# EAGLE design PowerBrick (EAGLE 6.0)
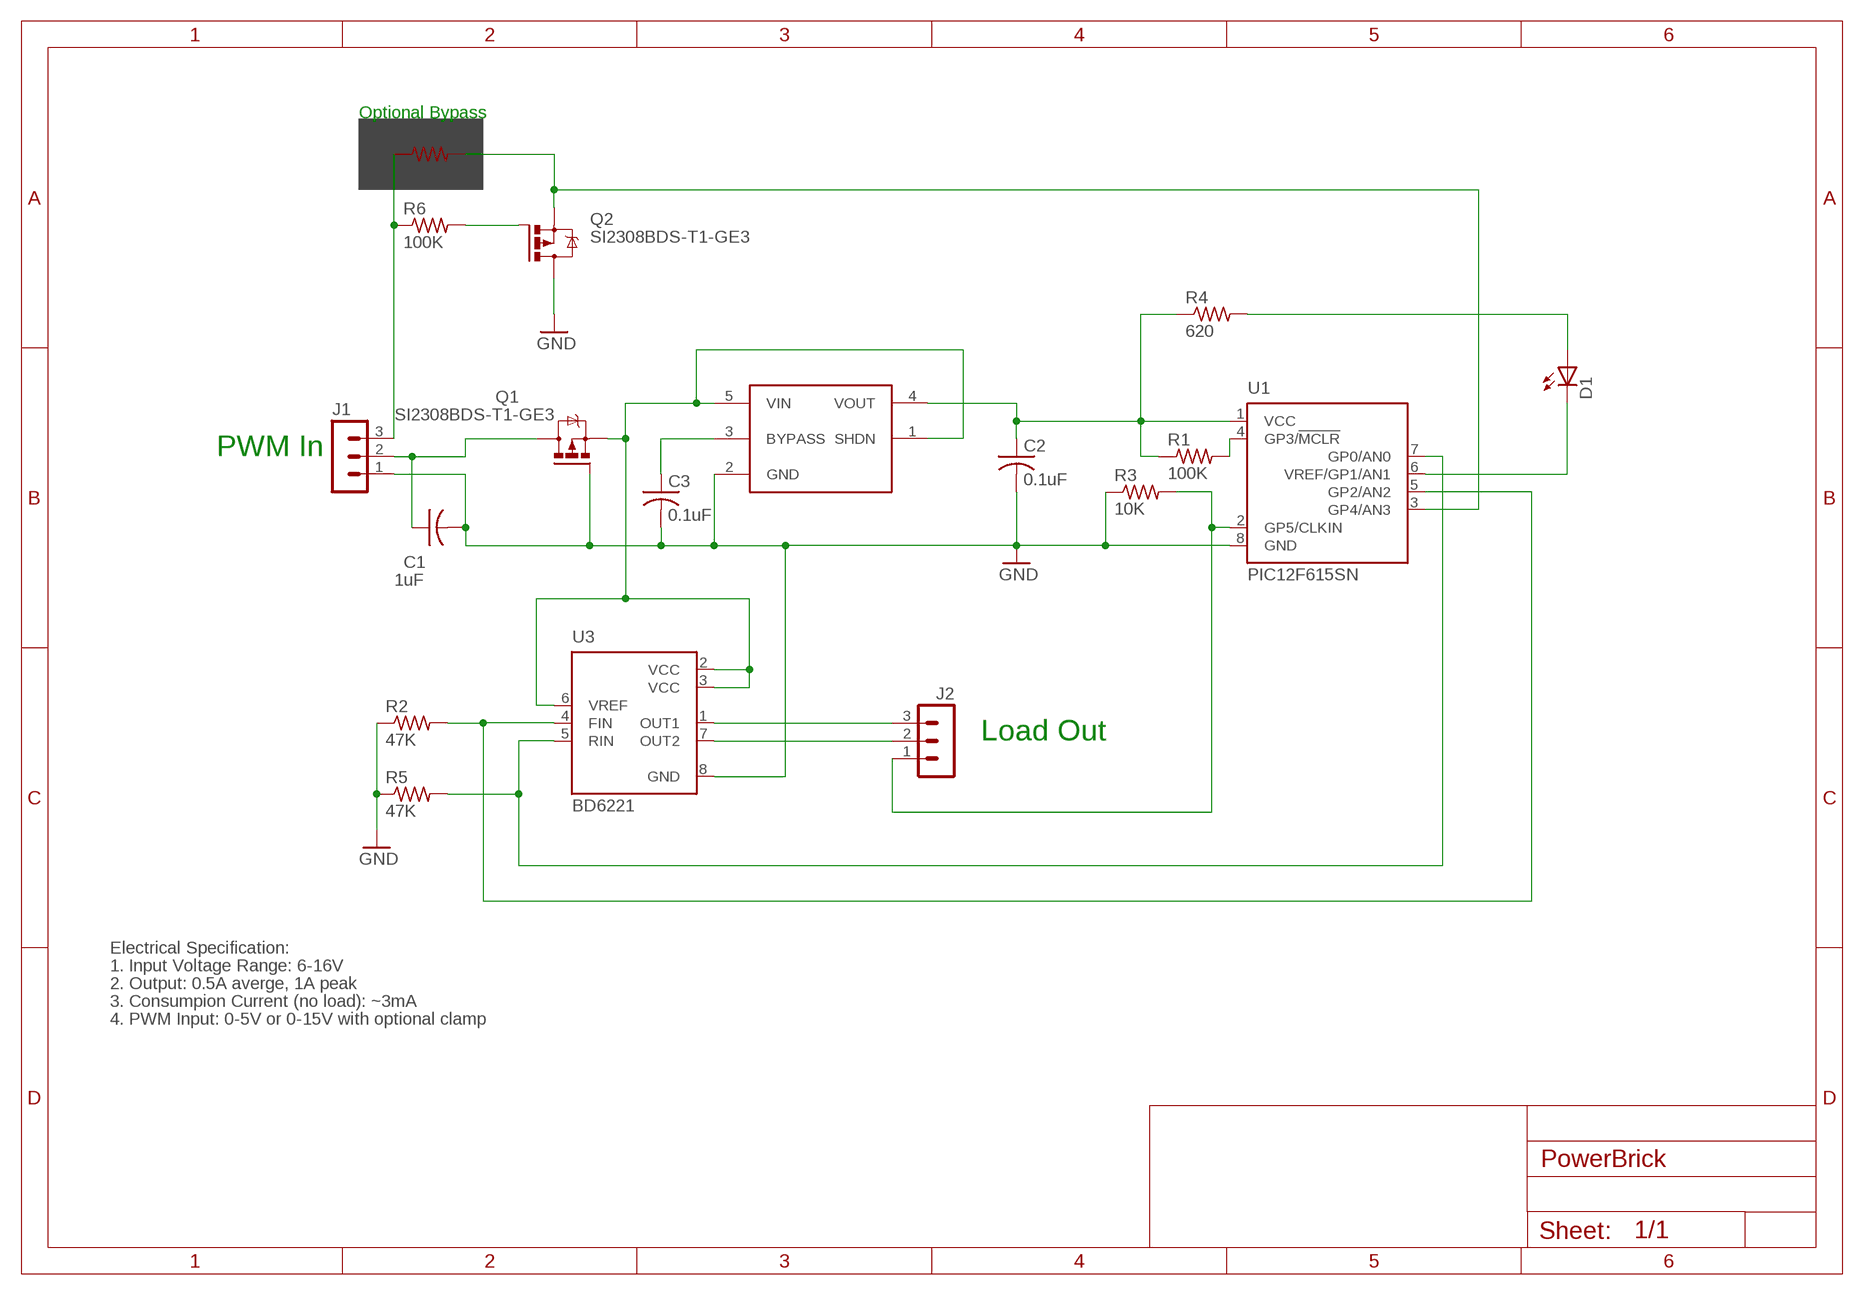
[diagram p0: schematic, sheet 1]

## Parts
C1  1uF  C-USC0805  [C0805]
C2  0.1uF  C-USC0805  [C0805]
C3  0.1uF  C-USC0805  [C0805]
D1  LEDCHIPLED_0603  [CHIPLED_0603]
J1  MA03-1  [MA03-1]
J2  MA03-1  [MA03-1]
Q1  SI2308BDS-T1-GE3  IRLML5203  [MICRO3]
Q2  SI2308BDS-T1-GE3  IRLML5203  [MICRO3]
R1  100K  R-US_R0603  [R0603]
R2  47K  R-US_R0603  [R0603]
R3  10K  R-US_R0603  [R0603]
R4  620  R-US_R0603  [R0603]
R5  47K  R-US_R0603  [R0603]
R6  100K  R-US_R0603  [R0603]
R7  0  R-US_R0603  [R0603]
U1  PIC12F615SN  PIC12H615SN  [SO-08]
U2  LK112M50TR  [SOT23-5L]
U3  BD6221  BD62XXBD6221  [SOP8]

## Nets
GND [power]: C1.2 C2.2 C3.2 J1.1 Q1.1(G) Q2.3(D) R2.1 R3.1 R5.1 U1.8(GND) U2.2(GND) U3.8(GND)
J1: Q2.2(S) R7.2 U1.3(GP4/AN3)
N$1 [power]: J2.1 R3.2 U1.2(GP5/CLKIN)
N$2 [power]: Q1.2(S) U2.1(SHDN) U2.5(VIN) U3.2(VCC) U3.3(VCC) U3.6(VREF)
N$3: C2.1 R1.1 R4.1 U1.1(VCC) U2.4(VOUT)
N$4: J2.3 U3.1(OUT1)
N$5 [power]: J2.2 U3.7(OUT2)
N$6: R2.2 U1.5(GP2/AN2) U3.4(FIN)
N$7: R5.2 U1.7(GP0/AN0) U3.5(RIN)
N$8: D1.A R4.2
N$9: D1.C U1.6(VREF/GP1/AN1)
N$10 [power]: C1.1 J1.2 Q1.3(D)
N$11: R1.2 U1.4(GP3/!MCLR)
N$12: Q2.1(G) R6.2
N$13: J1.3 R6.1 R7.1
N$15: C3.1 U2.3(BYPASS)

## Notes on the sheet
- Optional Bypass
- PWM In
- Load Out
- Electrical Specification:
- 1. Input Voltage Range: 6-16V
- 2. Output: 0.5A averge, 1A peak
- 3. Consumpion Current (no load): ~3mA
- 4. PWM Input: 0-5V or 0-15V with optional clamp

## Library data of the parts
C1-C3 = rcl:C-US: CAPACITOR, American symbol
D1 = led:LED: LED OSRAM: - CHIPLED LG R971, LG N971, LY N971, LG Q971, LY Q971, LO R971, LY R971 LH N974, LH R974 LS Q976, LO Q976, LY Q976 LO Q996 - Hyper CHIPLED LW Q18S LB Q993, LB Q99A, LB R99A - SideLED LS A670, LO A670, LY A670, LG A670, LP A670 LB A673, LV A673, LT A673, LW A673 LH A674 LY A675 LS A676, LA A676, LO A676, LY A676, LW A676 LS A679, LY A679, LG A679 - Hyper Micro SIDELED® LS Y876, LA Y876, LO Y876, LY Y876 LT Y87S - SmartLED LW L88C, LW L88S LB L89C, LB L89S, LG L890 LS L89K, LO L89K, LY L89K LS L896, LA L896, LO L896, LY L896 - TOPLED LS T670, LO T670, LY T670, LG T670, LP T670 LSG T670, LSP T670, LSY T670, LOP T670, LYG T670 LG T671, LOG T671, LSG T671 LB T673, LV T673, LT T673, LW T673 LH T674 LS T676, LA T676, LO T676, LY T676, LB T676, LH T676, LSB T676, LW T676 LB T67C, LV T67C, LT T67C, LS T67K, LO T67K, LY T67K, LW E67C LS E67B, LA E67B, LO E67B, LY E67B, LB E67C, LV E67C, LT E67C LW T67C LS T679, LY T679, LG T679 LS T770, LO T770, LY T770, LG T770, LP T770 LB T773, LV T773, LT T773, LW T773 LH T774 LS E675, LA E675, LY E675, LS T675 LS T776, LA T776, LO T776, LY T776, LB T776 LHGB T686 LT T68C, LB T68C - Hyper Mini TOPLED® LB M676 - Mini TOPLED Santana® LG M470 LS M47K, LO M47K, LY M47K Source: http://www.osram.convergy.de LUXEON: - LUMILED® LXK2-PW12-R00, LXK2-PW12-S00, LXK2-PW14-U00, LXK2-PW14-V00 LXK2-PM12-R00, LXK2-PM12-S00, LXK2-PM14-U00 LXK2-PE12-Q00, LXK2-PE12-R00, LXK2-PE12-S00, LXK2-PE14-T00, LXK2-PE14-U00 LXK2-PB12-K00, LXK2-PB12-L00, LXK2-PB12-M00, LXK2-PB14-N00, LXK2-PB14-P00, LXK2-PB14-Q00 LXK2-PR12-L00, LXK2-PR12-M00, LXK2-PR14-Q00, LXK2-PR14-R00 LXK2-PD12-Q00, LXK2-PD12-R00, LXK2-PD12-S00 LXK2-PH12-R00, LXK2-PH12-S00 LXK2-PL12-P00, LXK2-PL12-Q00, LXK2-PL12-R00 Source: www.luxeon.com KINGBRIGHT: KA-3528ASYC Source: www.kingbright.com
J1 J2 = con-lstb:MA03-1: PIN HEADER; OC_FARNELL: unknown; OC_NEWARK: unknown
Q1 Q2 = transistor-power:IRLML5203: HEXFET P-Channel Power MOSFET
R1-R7 = resistor:R-US_: RESISTOR, American symbol
U1 = personal:PIC12H615: 8-Pin FLASH-Based 8-Bit CMOS Microcontroller Precision Internal 4 MHz oscillator factory calibrated to ±1% Low Power Features: Standby Current: - 1 nA @ 2.0V, typical Operating Current: - 8.5µA @ 32 kHz, 2.0V, typical - 100µA @ 1 MHz, 2.0V, typical Watchdog Timer Current: - 300 nA @ 2.0V, typical Timer1 oscillator current: - 4µA @ 32 kHz, 2.0V, typical Analog-to-Digital Converter module: - 10-bit resolution - Programmable 4-channel input - Voltage reference input; MF: MICROCHIP; MPN: PIC12F675-E/SN; OC_FARNELL: 9759026; OC_NEWARK: 92C4341
U2 = personal:LK112M50TR: LDO, 5V, 150mA Datasheet: http://www.st.com/internet/com/TECHNICAL_RESOURCES/TECHNICAL_LITERATURE/DATASHEET/CD00002190.pdf
U3 = personal:BD62XX: H-bridge driver for brush motors Source: http://www.rohm.com/products/databook/motor/pdf/bd623x_series-e.pdf

## Net classes
0 default: width 0.203 mm
1 power: width 0.406 mm

## Board
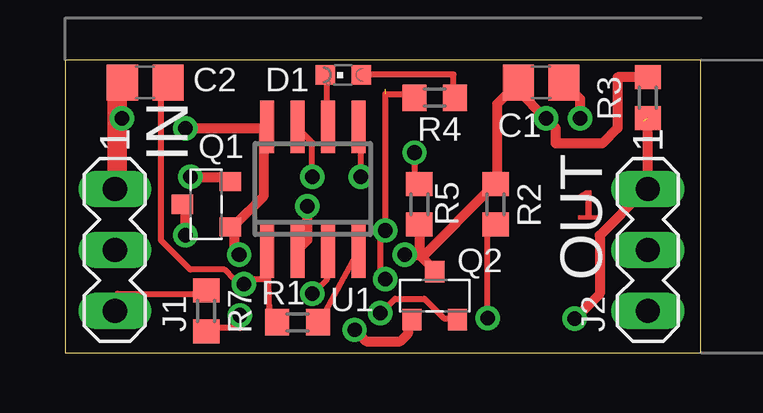
[diagram p1: board, top side]
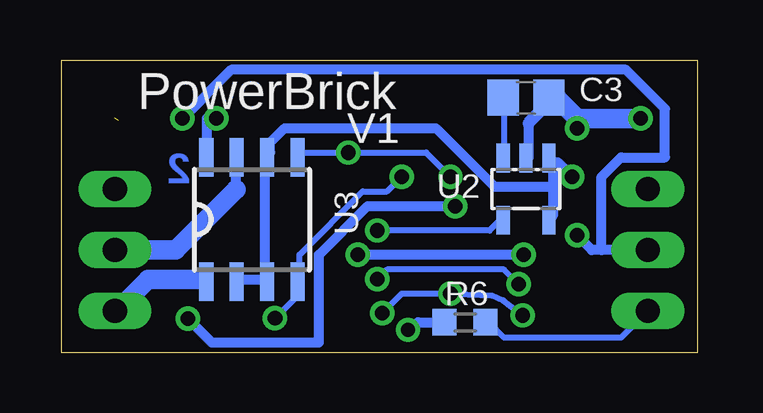
[diagram p2: board, bottom side, seen from below]

Size 26.5 x 12.21 mm. Coordinates in mm from the lower left corner, seen from the top.
Outline: 0,0 26.5,0 26.5,12.21 0,12.21 0,0
Copper layers (1*16): Top 0.035mm / dielectric 1.5mm / Bottom 0.035mm
Design rules: minimum track width 10mil, minimum drill 24mil, track to track 8mil, track to pad 8mil, pad to pad 8mil, via to via 8mil, smd to smd 8mil, copper to edge 40mil, drill to drill 8mil, minimum pad ring 10mil, minimum via ring 8mil, stop-mask expansion 4mil, vias tented up to drill 0mil, thermal gap 10mil

### Footprints (pad centres in the part's own frame; a part is rotated, then mirrored left to right if it is on the bottom)
C0805 = smd 1.3 x 1.5: 1 -0.95,0; 2 0.95,0
CHIPLED_0603 = smd 0.8 x 0.8: A 0,-0.75; C 0,0.75
MA03-1 = drill 1.016 long: 1 -2.54,0; 2 0,0; 3 2.54,0
MICRO3 = smd 0.8 x 0.9: 1 -0.95,-1; 2 0.95,-1; 3 0,1
R0603 = smd 1 x 1.1: 1 -0.85,0; 2 0.85,0
SO-08 = smd 0.6 x 2.2: 1 -1.905,-2.6; 2 -0.635,-2.6; 3 0.635,-2.6; 4 1.905,-2.6; 5 1.905,2.6; 6 0.635,2.6; 7 -0.635,2.6; 8 -1.905,2.6
SOT23-5L = smd 0.55 x 1.2: 1 -0.95,-1.3; 2 0,-1.3; 3 0.95,-1.3; 4 0.95,1.3; 5 -0.95,1.3
SOP8 = smd 0.6 x 1.6: 1 -1.905,-2.6; 2 -0.635,-2.6; 3 0.635,-2.6; 4 1.905,-2.6; 5 1.905,2.6; 6 0.635,2.6; 7 -0.635,2.6; 8 -1.905,2.6

### Placement (x,y rotation side)
C1  19.84,11.27 180 top
C2  3.33,11.27 180 top
C3  7.14,10.64 0 bottom
D1  11.59,11.59 90 top
J1  2.06,4.29 270 top
J2  24.29,4.29 270 top
Q1  5.87,6.19 90 top
Q2  15.4,2.38 0 top
R1  9.68,1.27 0 top
R2  17.94,6.19 270 top
R3  24.29,10.64 270 top
R4  15.4,10.64 0 top
R5  14.76,6.19 90 top
R6  9.68,1.27 180 bottom
R7  5.87,1.75 270 top
U1  10.32,6.83 0 top
U2  7.14,6.83 180 bottom
U3  18.57,5.56 0 bottom

### Tracks (layer width: path | path; a pad name or v marks a point on that pad's centre or on a via)
GND  (via drill 0.61)
  Top 0.406: 14.76,4.08 14.87,3.98 | 14.87,3.98 15.37,3.47 Q2.3 | R5.1 14.76,4.08 | 14.87,3.98 17.81,6.93 R2.1 18.01,7.13 18.01,10.38 18.83,11.2 C1.2 18.83,10.99 v20.05,9.77 20.45,9.37 20.45,8.73 22.38,8.73 23.02,9.37 23.02,11.49 R3.1 | 8.26,9.37 8.26,6.52 7.04,5.3 Q1.1 7.04,5.1 7.04,4.29 v7.25,4.08 | 8.26,9.37 U1.8 8.46,9.57 | 2.17,10.99 2.37,11.2 C2.2 | 2.17,6.93 J1.1 | 2.17,9.77 v2.37,9.77 | v5.01,9.37 8.26,9.37 | v14.15,4.08 14.76,4.08
  Top 0.813: 2.17,6.93 2.17,9.77 2.17,10.99
  Bottom 0.406: 7.04,9.57 7.04,8.15 U2.2 | 6.03,10.59 C3.2 5.82,10.59 | 5.01,9.77 v5.01,9.37 | v7.25,4.08 v14.15,4.08 | v20.05,9.77 20.45,9.77 20.45,8.35 U3.8
  Bottom 0.508: 6.03,10.59 7.04,9.57
  Bottom 0.813: 5.82,10.59 5.01,9.77 v2.37,9.77
J1  (via drill 0.61)
  Top 0.254: v13.14,1.64 13.75,2.25 14.97,2.25 15.78,1.44 16.19,1.44 Q2.2 | v10.29,2.46 10.9,3.07 10.9,4.08 U1.3 | v7.28,1.56 7.28,1.04 6.03,1.04 R7.2
  Bottom 0.254: v13.14,1.64 12.33,2.46 v10.29,2.46 10.09,2.46 8.57,2.38 8.1,2.19 v7.28,1.56
N$1  (via drill 0.61)  (1 unrouted)
  Top 0.406: v10.09,6.12 10.09,4.69 9.68,4.29 U1.2 | v21.24,1.42 22.28,2.46 22.28,4.9 24.11,6.72 J2.1 24.29,9.53 24.13,9.68
  Bottom 0.406: v10.09,6.12 13.75,6.12 15.78,4.08 15.78,0.43 20.25,0.43 v21.24,1.42
N$2  (via drill 0.61)
  Top 0.406: v5.21,7.33 6.84,7.33 Q1.2
  Bottom 0.406: v5.21,7.33 5.82,7.94 6.03,7.94 U2.1 6.03,7.74 6.03,6.93 | 6.03,6.93 6.03,5.71 U2.5 | U3.2 19.03,3.07 18.01,3.07 U3.3 18.01,3.27 18.01,8.15 U3.6 17.81,8.35 17.81,8.76 17.2,9.37 10.9,9.37 8.46,6.93 6.03,6.93
N$3  (via drill 0.61)  (1 unrouted)
  Top 0.254: 8.46,3.07 8.46,4.08 U1.1 | 8.46,3.07 8.46,2.86 8.5,1.71 R1.1 | 8.46,3.07 7.45,3.07 | 7.45,3.07 7.04,3.07 6.64,3.47 5.21,3.47 3.99,4.69 3.99,10.99 4.2,11.2 C2.1 | v13.34,3.07 13.14,3.27 13.14,4.9 v13.34,5.1 13.34,10.79 14.36,10.79 R4.1 | 7.45,3.07 v7.45,2.86
  Bottom 0.254: v13.34,5.1 8.67,5.1 8.26,5.51 U2.4 | v13.34,3.07 12.93,3.47 8.06,3.47 v7.45,2.86
N$4
  Bottom 0.254: 20.66,3.07 U3.1 | 24.11,1.85 J2.3
  Bottom 0.813: 20.66,3.07 22.89,3.07 24.11,1.85
N$5
  Bottom 0.406: 19.23,6.8 19.23,8.15 U3.7
  Bottom 0.813: J2.2 21.75,4.29 19.23,6.8
N$6  (via drill 0.61)
  Top 0.254: v17.61,1.44 17.61,5.1 17.81,5.3 R2.2 | v12.33,7.33 12.33,9.37 U1.5
  Bottom 0.254: v17.61,1.44 16.8,2.25 16.8,2.86 U3.4 16.59,3.07 16.59,4.08 13.95,6.72 12.93,6.72 v12.33,7.33
N$7  (via drill 0.61)
  Top 0.254: v14.56,8.35 14.56,7.33 14.76,7.13 R5.2 | v10.29,7.33 10.29,8.76 9.68,9.37 U1.7
  Bottom 0.254: U3.5 16.59,8.35 v14.56,8.35 11.31,8.35 v10.29,7.33
N$8
  Top 0.254: D1.A 12.53,11.6 16.19,11.6 16.19,10.79 R4.2
N$9
  Top 0.254: 11.11,9.57 U1.6 10.9,9.57 10.9,11.4 D1.C
N$10  (via drill 0.61)
  Top 0.406: v5.01,4.9 5.01,6.12 Q1.3 | v21.47,9.77 21.47,10.59 20.86,11.2 C1.1
  Bottom 0.406: v5.01,4.9 4.4,4.29 3.99,4.29 | J1.2 3.99,4.29 | v21.47,9.77 19.44,11.8 2.98,11.8 1.35,10.18 1.35,8.15 3.18,8.15 3.99,7.33 3.99,4.29
N$11
  Top 0.254: R1.2 10.49,1.24 10.69,1.44 12.12,4.08 U1.4
N$12  (via drill 0.6)
  Top 0.254: 14.56,1.24 Q2.1
  Top 0.406: Q2.1 14.29,1.38 14.29,0.79 13.97,0.48 12.54,0.48 v12.06,0.95
  Bottom 0.406: v12.06,0.95 11.64,1.27 R6.2
N$13
  Top 0.254: R7.1 5.82,2.46 2.17,2.46 2.17,1.85 J1.3
  Bottom 0.254: J1.3 3.18,0.63 8.06,0.63 8.67,1.24 R6.1
N$15
  Bottom 0.254: U2.3 8.06,8.15 8.06,10.59 C3.1

### Text on the board
Top: 1
Bottom: 2
tNames: IN | OUT
bNames: PowerBrick | V1